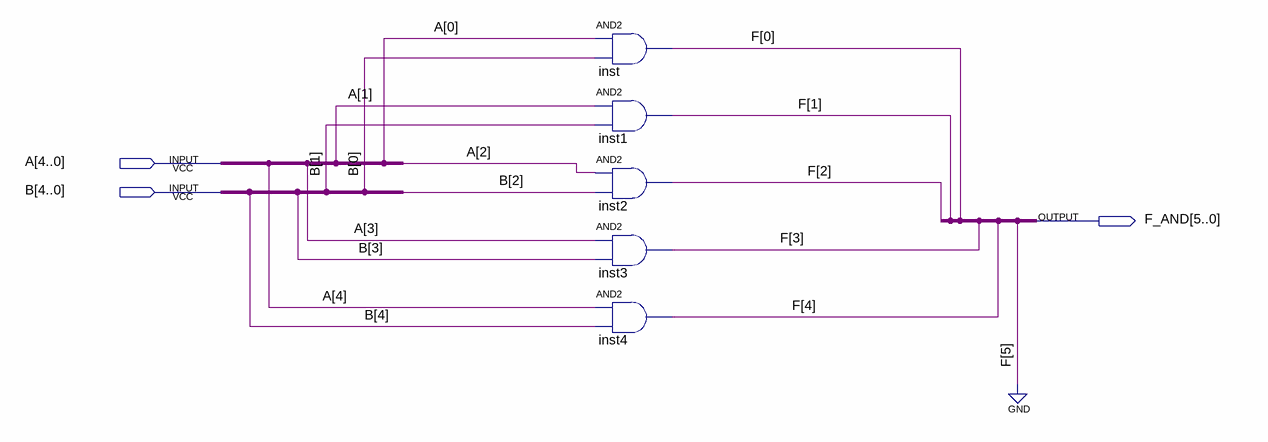
[diagram p0: schematic sheet]
// Quartus schematic And_5bits.bdf as structural Verilog: 5 symbols, 3 pins
module And_5bits (
  input  [4:0] A,
  input  [4:0] B,
  output [5:0] F_AND
);

  wire [4:0] F;

  and inst (F[0], A[0], B[0]);
  and inst1 (F[1], A[1], B[1]);
  and inst2 (F[2], A[2], B[2]);
  and inst3 (F[3], A[3], B[3]);
  and inst4 (F[4], A[4], B[4]);
endmodule
